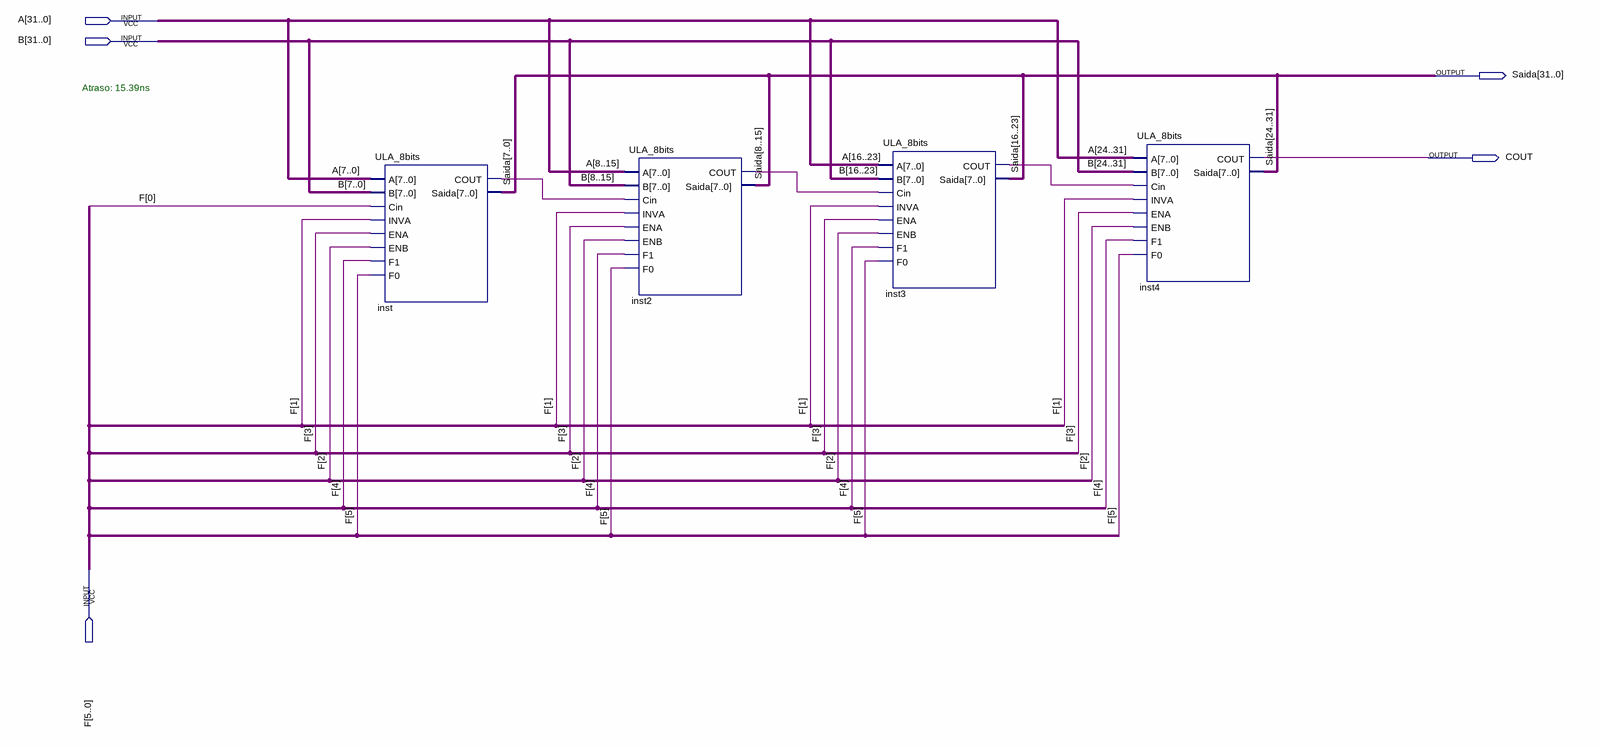
[diagram p0: schematic sheet]
// Quartus schematic ULA_32bits.bdf as structural Verilog: 4 symbols, 5 pins
module ULA_32bits (
  input  [31:0] A,
  input  [31:0] B,
  input  [5:0] F,
  output [31:0] Saida,
  output COUT
);

  wire inst2_cout, inst3_cout, inst_cout;

  ULA_8bits inst (
    .A(A[7:0]), .B(B[7:0]), .Cin(F[0]), .INVA(F[1]), .ENA(F[3]), .ENB(F[2]), .F1(F[4]), .F0(F[5]),
    .COUT(inst_cout), .Saida(Saida[7:0]));
  ULA_8bits inst2 (
    .A({A[8], A[9], A[10], A[11], A[12], A[13], A[14], A[15]}),
    .B({B[8], B[9], B[10], B[11], B[12], B[13], B[14], B[15]}), .Cin(inst_cout), .INVA(F[1]), .ENA(F[3]),
    .ENB(F[2]), .F1(F[4]), .F0(F[5]), .COUT(inst2_cout),
    .Saida({Saida[8], Saida[9], Saida[10], Saida[11], Saida[12], Saida[13], Saida[14], Saida[15]}));
  ULA_8bits inst3 (
    .A({A[16], A[17], A[18], A[19], A[20], A[21], A[22], A[23]}),
    .B({B[16], B[17], B[18], B[19], B[20], B[21], B[22], B[23]}), .Cin(inst2_cout), .INVA(F[1]), .ENA(F[3]),
    .ENB(F[2]), .F1(F[4]), .F0(F[5]), .COUT(inst3_cout),
    .Saida({Saida[16], Saida[17], Saida[18], Saida[19], Saida[20], Saida[21], Saida[22], Saida[23]}));
  ULA_8bits inst4 (
    .A({A[24], A[25], A[26], A[27], A[28], A[29], A[30], A[31]}),
    .B({B[24], B[25], B[26], B[27], B[28], B[29], B[30], B[31]}), .Cin(inst3_cout), .INVA(F[1]), .ENA(F[3]),
    .ENB(F[2]), .F1(F[4]), .F0(F[5]), .COUT(COUT),
    .Saida({Saida[24], Saida[25], Saida[26], Saida[27], Saida[28], Saida[29], Saida[30], Saida[31]}));

  // Notes on the sheet:
  //   Atraso: 15.39ns
endmodule
